# EAGLE design Main (EAGLE 9.6.2)
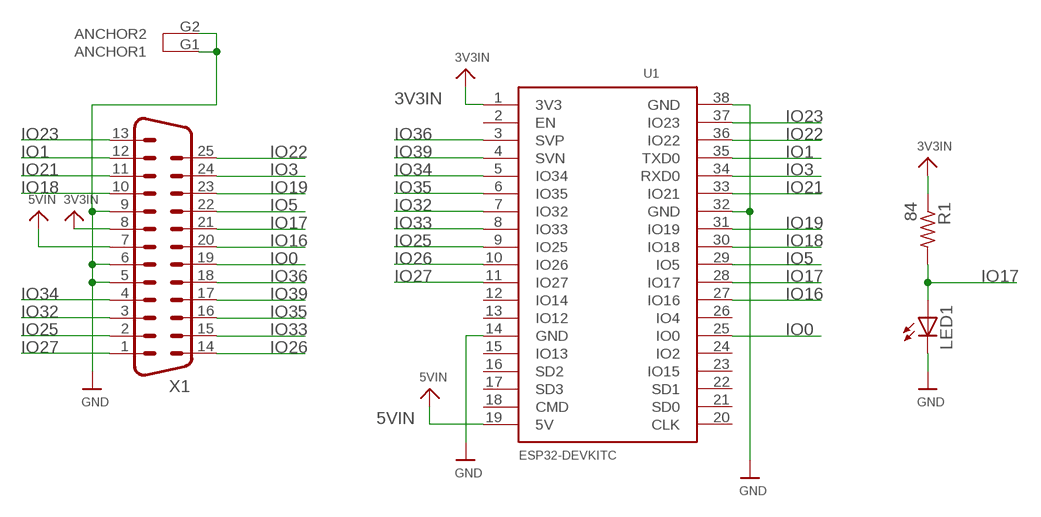
[diagram p0: schematic, sheet 1]

## Parts
LED1  LEDCHIPLED_1206  [CHIPLED_1206]
R1  84  R-US_R1206  [R1206]
U1  ESP32DEVKITC  [ESP32-DEVKITC]
X1  DB25_MALEHP  [M25HP]

## Nets
3V3IN: R1.1 U1.1(3V3) X1.8
5VIN: U1.19(5V) X1.7
GND: LED1.C U1.14(GND) U1.32(GND) U1.38(GND) X1.5 X1.6 X1.9 X1.G1(ANCHOR1) X1.G2(ANCHOR2)
IO0: U1.25(IO0) X1.19
IO1: U1.35(TXD0) X1.12
IO3: U1.34(RXD0) X1.24
IO5: U1.29(IO5) X1.22
IO16: U1.27(IO16) X1.20
IO17: LED1.A R1.2 U1.28(IO17) X1.21
IO18: U1.30(IO18) X1.10
IO19: U1.31(IO19) X1.23
IO21: U1.33(IO21) X1.11
IO22: U1.36(IO22) X1.25
IO23: U1.37(IO23) X1.13
IO25: U1.9(IO25) X1.2
IO26: U1.10(IO26) X1.14
IO27: U1.11(IO27) X1.1
IO32: U1.7(IO32) X1.3
IO33: U1.8(IO33) X1.15
IO34: U1.5(IO34) X1.4
IO35: U1.6(IO35) X1.16
IO36: U1.3(SVP) X1.18
IO39: U1.4(SVN) X1.17
Unconnected: U1.2(EN) U1.12(IO14) U1.13(IO12) U1.15(IO13) U1.16(SD2) U1.17(SD3) U1.18(CMD) U1.20(CLK) U1.21(SD0) U1.22(SD1) U1.23(IO15) U1.24(IO2) U1.26(IO4)

## Library data of the parts
LED1 = adafruit:LED: LED OSRAM: - CHIPLED LG R971, LG N971, LY N971, LG Q971, LY Q971, LO R971, LY R971 LH N974, LH R974 LS Q976, LO Q976, LY Q976 LO Q996 - Hyper CHIPLED LW Q18S LB Q993, LB Q99A, LB R99A - SideLED LS A670, LO A670, LY A670, LG A670, LP A670 LB A673, LV A673, LT A673, LW A673 LH A674 LY A675 LS A676, LA A676, LO A676, LY A676, LW A676 LS A679, LY A679, LG A679 - Hyper Micro SIDELED® LS Y876, LA Y876, LO Y876, LY Y876 LT Y87S - SmartLED LW L88C, LW L88S LB L89C, LB L89S, LG L890 LS L89K, LO L89K, LY L89K LS L896, LA L896, LO L896, LY L896 - TOPLED LS T670, LO T670, LY T670, LG T670, LP T670 LSG T670, LSP T670, LSY T670, LOP T670, LYG T670 LG T671, LOG T671, LSG T671 LB T673, LV T673, LT T673, LW T673 LH T674 LS T676, LA T676, LO T676, LY T676, LB T676, LH T676, LSB T676, LW T676 LB T67C, LV T67C, LT T67C, LS T67K, LO T67K, LY T67K, LW E67C LS E67B, LA E67B, LO E67B, LY E67B, LB E67C, LV E67C, LT E67C LW T67C LS T679, LY T679, LG T679 LS T770, LO T770, LY T770, LG T770, LP T770 LB T773, LV T773, LT T773, LW T773 LH T774 LS E675, LA E675, LY E675, LS T675 LS T776, LA T776, LO T776, LY T776, LB T776 LHGB T686 LT T68C, LB T68C - Hyper Mini TOPLED® LB M676 - Mini TOPLED Santana® LG M470 LS M47K, LO M47K, LY M47K Source: http://www.osram.convergy.de/
R1 = adafruit:R-US_: RESISTOR, American symbol
U1 = ESP32-DEVKITC4:ESP32DEVKITC
X1 = SparkFun-Retired:DB25_MALE: Various DB25 connectors

## Board
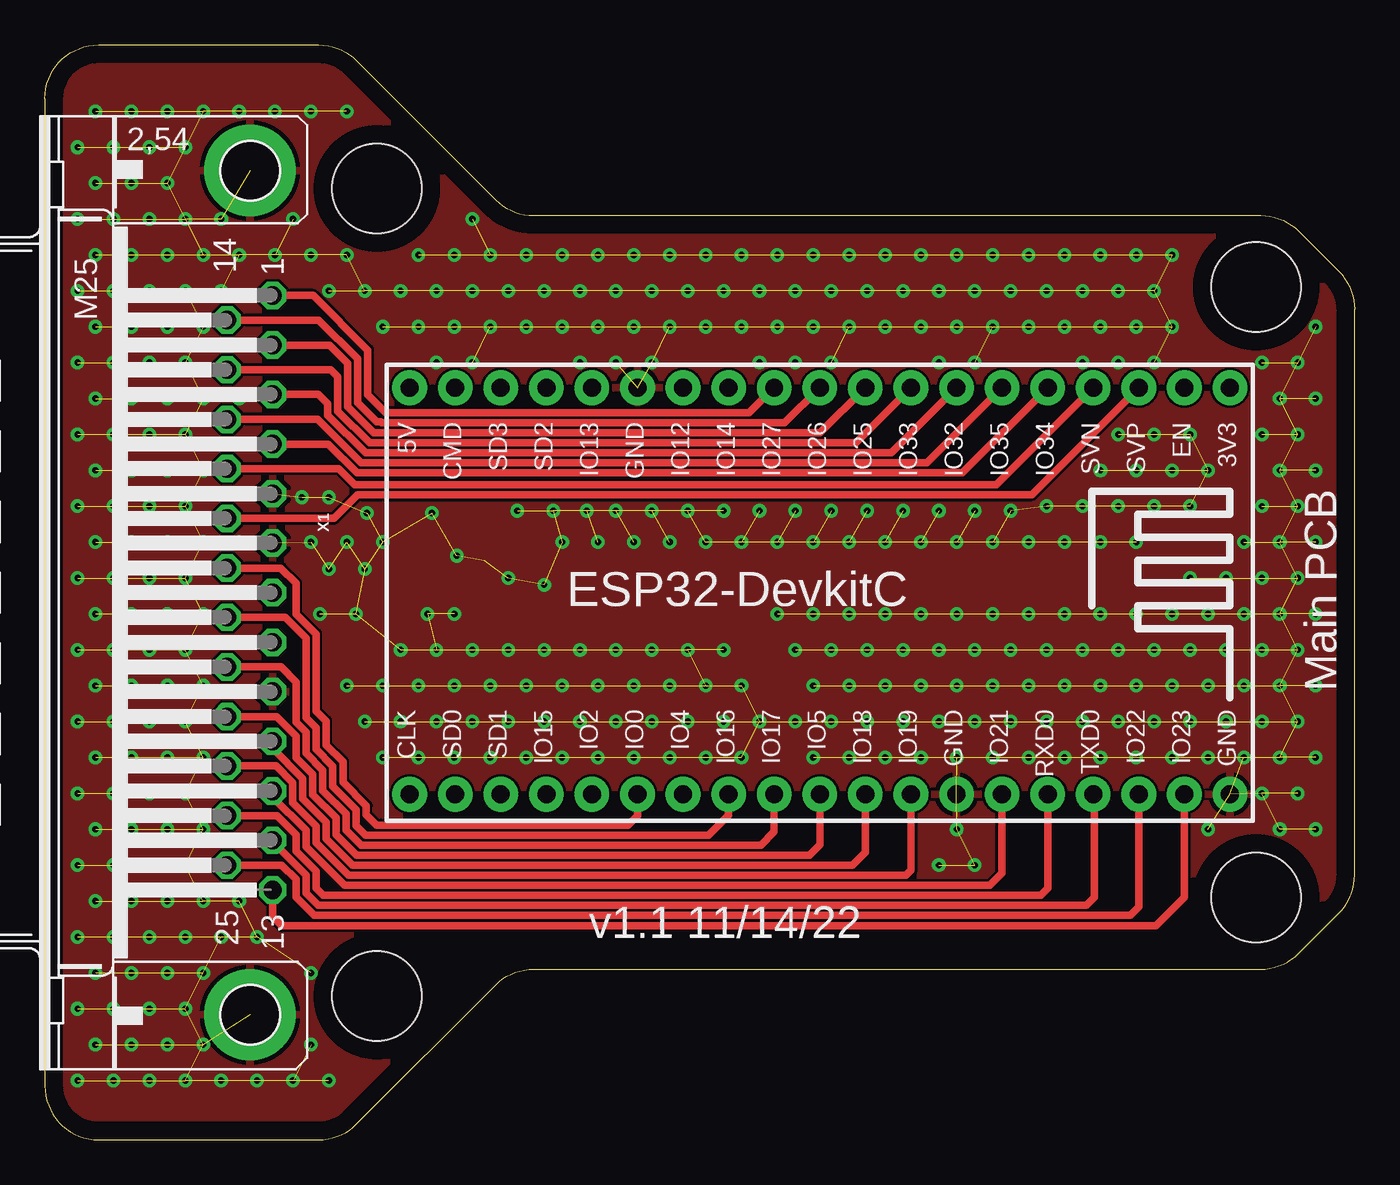
[diagram p1: board, top side]
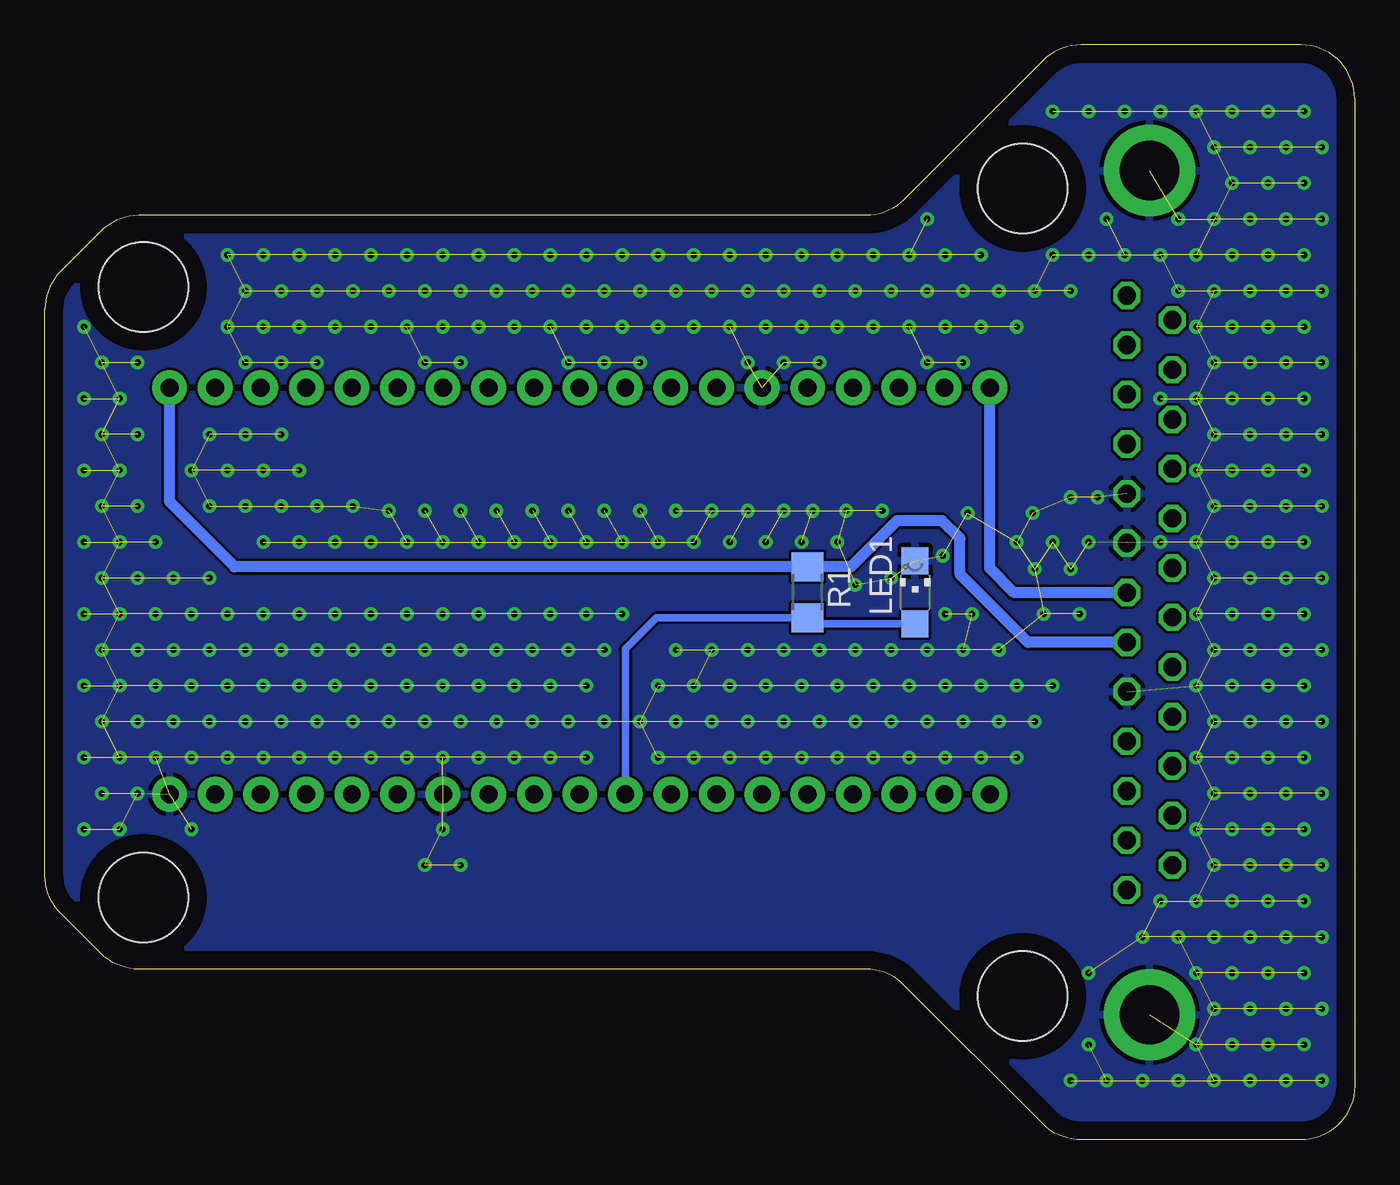
[diagram p2: board, bottom side, seen from below]

Size 73 x 61 mm. Coordinates in mm from the lower left corner, seen from the top.
Outline: 0,58 0,3 arc90 3,0 15.26,0 arc45 17.38,0.88 25.12,8.62 arc-45 27.24,9.5 67.76,9.5 arc45 69.88,10.38 72.12,12.62 arc45 73,14.74 73,46.26 arc45 72.12,48.38 69.88,50.62 arc45 67.76,51.5 27.24,51.5 arc-45 25.12,52.38 17.38,60.12 arc45 15.26,61 3,61 arc90 0,58
Copper layers (1*16): Top 0.035mm / dielectric 1.5mm / Bottom 0.035mm
Design rules "default": minimum track width 6mil, minimum drill 0.35mm, track to track 6mil, track to pad 6mil, pad to pad 6mil, via to via 6mil, smd to smd 6mil, copper to edge 40mil, drill to drill 6mil, minimum pad ring 10mil, minimum via ring 8mil, stop-mask expansion 4mil, vias tented up to drill 0.5mm, thermal gap 10mil
Holes 5 mm at 67.5,13.5 67.5,47.5 18.5,53 18.5,8

### Footprints (pad centres in the part's own frame; a part is rotated, then mirrored left to right if it is on the bottom)
CHIPLED_1206 = smd 1.5 x 1.5: A 0,-1.75; C 0,1.75
R1206 = smd 1.6 x 1.803: 1 -1.422,0; 2 1.422,0
ESP32-DEVKITC = drill 1 pad 1.93: 1 -22.87,-11.42; 2 -20.33,-11.42; 3 -17.79,-11.42; 4 -15.25,-11.42; 5 -12.71,-11.42; 6 -10.17,-11.42; 7 -7.63,-11.42; 8 -5.09,-11.42; 9 -2.55,-11.42; 10 -0.01,-11.42; 11 2.53,-11.42; 12 5.07,-11.42; 13 7.61,-11.42; 14 10.15,-11.42; 15 12.69,-11.42; 16 15.23,-11.42; 17 17.77,-11.42; 18 20.31,-11.42; 19 22.85,-11.42; 20 22.85,11.23; 21 20.31,11.23; 22 17.77,11.23; 23 15.23,11.23; 24 12.69,11.23; 25 10.15,11.23; 26 7.61,11.23; 27 5.07,11.23; 28 2.53,11.23; 29 -0.01,11.23; 30 -2.55,11.23; 31 -5.09,11.23; 32 -7.63,11.23; 33 -10.17,11.23; 34 -12.71,11.23; 35 -15.25,11.23; 36 -17.79,11.23; 37 -20.33,11.23; 38 -22.87,11.23
M25HP = drill 1.016 octagon: 1 -16.561,1.27; 2 -13.792,1.27; 3 -11.049,1.27; 4 -8.28,1.27; 5 -5.512,1.27; 6 -2.769,1.27; 7 0,1.27; 8 2.769,1.27; 9 5.512,1.27; 10 8.28,1.27; 11 11.049,1.27; 12 13.792,1.27; 13 16.561,1.27; 14 -15.189,-1.27; 15 -12.421,-1.27; 16 -9.652,-1.27; 17 -6.909,-1.27; 18 -4.14,-1.27; 19 -1.372,-1.27; 20 1.372,-1.27; 21 4.14,-1.27; 22 6.909,-1.27; 23 9.652,-1.27; 24 12.421,-1.27; 25 15.189,-1.27 | drill 3.302 pad 5.08: G1 -23.52,0; G2 23.52,0

### Placement (x,y rotation side)
LED1  24.5,30.5 0 bottom
R1  30.5,30.5 270 bottom
U1  43.18,30.48 180 top
X1  11.43,30.48 270 top

### Tracks (layer width: path | path; a pad name or v marks a point on that pad's centre or on a via)
3V3IN
  Bottom 0.61: X1.8 18.21,27.71 22,31.5 22,33.5 23,34.5 25.5,34.5 28.08,31.92 R1.1 62.42,31.92 66.05,35.55 U1.1
5VIN
  Bottom 0.61: X1.7 18.98,30.48 20.33,31.83 U1.19
GND  (via drill 0.35)  (431 unrouted)
  other vias: 1.83,3.3 2.83,5.3 1.83,7.3 2.83,9.3 1.83,11.3 2.83,13.3 1.83,15.3 2.83,17.3 1.83,19.3 2.83,21.3 1.83,23.3 2.83,25.3 1.83,27.3 2.83,29.3 1.83,31.3 2.83,33.3 1.83,35.3 2.83,37.3 1.83,39.3 2.83,41.3 1.83,43.3 2.83,45.3 1.83,47.3 2.83,49.3 1.83,51.3 2.83,53.3 1.83,55.3 2.83,57.3 3.83,3.3 4.83,5.3 3.83,7.3 4.83,9.3 3.83,11.3 4.83,13.3 3.83,15.3 4.83,17.3 3.83,19.3 4.83,21.3 3.83,23.3 4.83,25.3 3.83,27.3 4.83,29.3 3.83,31.3 4.83,33.3 3.83,35.3 4.83,37.3 3.83,39.3 4.83,41.3 3.83,43.3 4.83,45.3 3.83,47.3 4.83,49.3 3.83,51.3 4.83,53.3 3.83,55.3 4.83,57.3 5.83,3.3 6.83,5.3 5.83,7.3 6.83,9.3 5.83,11.3 6.83,13.3 5.83,15.3 6.83,17.3 5.83,19.3 6.83,21.3 5.83,23.3 6.83,25.3 5.83,27.3 6.83,29.3 5.83,31.3 6.83,33.3 5.83,35.3 6.83,37.3 5.83,39.3 6.83,41.3 5.83,43.3 6.83,45.3 5.83,47.3 6.83,49.3 5.83,51.3 6.83,53.3 5.83,55.3 6.83,57.3 7.83,3.3 8.83,5.3 7.83,7.3 8.83,9.3 7.83,11.3 8.83,13.3 7.83,15.3 8.83,17.3 7.83,19.3 8.83,21.3 7.83,23.3 8.83,25.3 7.83,27.3 8.83,29.3 7.83,31.3 8.83,33.3 7.83,35.3 8.83,37.3 7.83,39.3 8.83,41.3 7.83,43.3 8.83,45.3 7.83,47.3 8.83,49.3 7.83,51.3 7.83,55.3 8.83,57.3 9.83,3.3 9.83,11.3 10.83,13.3 10.83,33.3 10.83,41.3 9.83,47.3 10.83,49.3 9.83,51.3 10.83,57.3 11.83,3.3 11.83,11.3 12.83,49.3 12.83,57.3 13.83,3.3 14.83,5.3 14.83,9.3 15.33,29.3 14.83,33.3 14.33,35.8 14.83,49.3 13.83,51.3 14.83,57.3 15.83,3.3 16.83,25.3 17.33,29.3 15.83,31.8 16.83,33.3 15.83,35.8 15.83,47.3 16.83,49.3 16.83,57.3 18.83,21.3 17.83,23.3 18.83,25.3 17.83,31.8 18.83,33.3 17.95,34.92 18.83,45.3 17.83,47.3 20.83,21.3 19.83,23.3 20.83,25.3 19.83,27.3 21.33,29.3 20.83,45.3 19.83,47.3 20.83,49.3 22.83,21.3 21.83,23.3 22.83,25.3 21.83,27.3 22.83,29.3 22.95,32.53 21.57,34.92 21.83,43.3 22.83,45.3 21.83,47.3 22.83,49.3 24.83,21.3 23.83,23.3 24.83,25.3 23.83,27.3 23.83,43.3 24.83,45.3 23.83,47.3 24.83,49.3 23.83,51.3 26.83,21.3 25.83,23.3 26.83,25.3 25.83,27.3 25.83,31.3 26.34,35.04 26.83,45.3 25.83,47.3 26.83,49.3 28.83,21.3 27.83,23.3 28.83,25.3 27.83,27.3 27.83,30.92 28.83,33.3 28.34,35.04 28.83,45.3 27.83,47.3 28.83,49.3 30.83,21.3 29.83,23.3 30.83,25.3 29.83,27.3 30.83,33.3 30.21,35.04 29.83,43.3 30.83,45.3 29.83,47.3 30.83,49.3 32.83,21.3 31.83,23.3 32.83,25.3 31.83,27.3 32.83,33.3 31.83,35.04 31.83,43.3 32.83,45.3 31.83,47.3 32.83,49.3 34.83,21.3 33.83,23.3 34.83,25.3 33.83,27.3 34.83,33.3 33.83,35.04 33.83,43.3 34.83,45.3 33.83,47.3 34.83,49.3 36.83,21.3 35.83,23.3 36.83,25.3 35.83,27.3 36.83,33.3 35.83,35.04 36.83,45.3 35.83,47.3 36.83,49.3 38.83,21.3 37.83,23.3 38.83,25.3 37.83,27.3 38.83,33.3 37.83,35.04 38.83,45.3 37.83,47.3 38.83,49.3 39.83,23.3 40.83,29.3 40.83,33.3 39.83,35.04 39.83,43.3 40.83,45.3 39.83,47.3 40.83,49.3 42.83,21.3 41.83,23.3 42.83,25.3 41.83,27.3 42.83,29.3 42.83,33.3 41.83,35.04 41.83,43.3 42.83,45.3 41.83,47.3 42.83,49.3 44.83,21.3 43.83,23.3 44.83,25.3 43.83,27.3 44.83,29.3 44.83,33.3 43.83,35.04 43.83,43.3 44.83,45.3 43.83,47.3 44.83,49.3 46.83,21.3 45.83,23.3 46.83,25.3 45.83,27.3 46.83,29.3 46.83,33.3 45.83,35.04 46.83,45.3 45.83,47.3 46.83,49.3 48.83,21.3 47.83,23.3 48.83,25.3 47.83,27.3 48.83,29.3 48.83,33.3 47.83,35.04 48.83,45.3 47.83,47.3 48.83,49.3 49.83,15.3 50.83,17.3 50.83,21.3 49.83,23.3 50.83,25.3 49.83,27.3 50.83,29.3 50.83,33.3 49.83,35.04 49.83,43.3 50.83,45.3 49.83,47.3 50.83,49.3 51.83,15.3 52.83,21.3 51.83,23.3 52.83,25.3 51.83,27.3 52.83,29.3 52.83,33.3 51.83,35.04 51.83,43.3 52.83,45.3 51.83,47.3 52.83,49.3 54.83,21.3 53.83,23.3 54.83,25.3 53.83,27.3 54.83,29.3 54.83,33.3 53.83,35.04 54.83,45.3 53.83,47.3 54.83,49.3 56.83,21.3 55.83,23.3 56.83,25.3 55.83,27.3 56.83,29.3 56.83,33.3 55.83,35.3 56.83,45.3 55.83,47.3 56.83,49.3 58.83,21.3 57.83,23.3 58.83,25.3 57.83,27.3 58.83,29.3 58.83,33.3 57.83,35.3 58.83,37.3 57.83,43.3 58.83,45.3 57.83,47.3 58.83,49.3 60.83,21.3 59.83,23.3 60.83,25.3 59.83,27.3 60.83,29.3 60.83,33.3 59.83,35.3 60.83,37.3 59.83,39.3 59.83,43.3 60.83,45.3 59.83,47.3 60.83,49.3 62.83,21.3 61.83,23.3 62.83,25.3 61.83,27.3 62.83,29.3 61.83,35.3 62.83,37.3 61.83,39.3 61.83,43.3 62.83,45.3 61.83,47.3 62.83,49.3 64.83,17.3 64.83,21.3 63.83,23.3 64.83,25.3 63.83,27.3 64.83,29.3 63.83,31.3 63.83,35.3 64.83,37.3 63.83,39.3 66.83,21.3 65.83,23.3 66.83,25.3 65.83,27.3 66.83,29.3 65.83,31.3 66.83,33.3 68.83,17.3 67.83,19.3 68.83,21.3 67.83,23.3 68.83,25.3 67.83,27.3 68.83,29.3 67.83,31.3 68.83,33.3 67.83,35.3 68.83,37.3 67.83,39.3 68.83,41.3 67.83,43.3 70.83,17.3 69.83,19.3 70.83,21.3 69.83,23.3 70.83,25.3 69.83,27.3 70.83,29.3 69.83,31.3 70.83,33.3 69.83,35.3 70.83,37.3 69.83,39.3 70.83,41.3 69.83,43.3 70.83,45.3
  pour Top: -0.5,-0.5 -0.5,61 15.5,61 28.5,61 28.5,51.5 73.5,51.5 73.5,42 73.5,9.5 64.5,9.5 29,9.5 29,0 29,-0.5
  pour Bottom: 0,0 0,61 28.5,61 28.5,51.5 73.5,51.5 73.5,9.5 28,9.5 28,0
IO0
  Top 0.406: U1.25 33.03,18.06 32.5,17.53 18.5,17.53 17.91,18.12 17.91,18.62 16.61,19.92 16.61,21.05 15.68,21.99 15.68,23.32 15.12,23.88 15.12,28.17 14,29.29 14,31 13.15,31.85 X1.19
IO1
  Top 0.406: U1.35 58.5,19.18 58.5,13.5 58.06,13.06 15.23,13.06 14.56,13.73 14.56,14.73 12.7,16.59 X1.12
IO3
  Top 0.406: U1.34 55.89,14.01 55.5,13.62 15.5,13.62 15.12,14 15.12,14.96 14,16.08 14,17 12.94,18.06 X1.24
IO5
  Top 0.406: U1.29 43.19,16.42 42.62,15.85 17.39,15.85 16.23,17.01 16.23,17.93 14.94,19.23 14.94,20.36 14,21.29 14,22.48 12.91,23.57 X1.22
IO16
  Top 0.406: X1.20 13.39,29.11 14.56,27.94 14.56,23.5 15.12,22.94 15.12,21.75 16.05,20.82 16.05,19.69 17.35,18.39 17.35,17.5 17.88,16.97 37,16.97 38.11,18.08 U1.27
IO17
  Top 0.406: U1.28 40.65,17.15 39.91,16.41 17.62,16.41 16.79,17.24 16.79,18.16 15.49,19.46 15.49,20.59 14.56,21.52 14.56,22.71 14,23.27 14,25.5 13.16,26.34 X1.21
  Bottom 0.406: U1.28 40.65,19.5 40.65,20.35 40.65,27.35 38.92,29.08 R1.2 30.17,28.75 LED1.A
IO18
  Top 0.406: U1.30 45.73,16.02 45,15.29 17.16,15.29 15.68,16.77 15.68,17.69 14.38,18.99 14.38,20.12 12.7,21.8 X1.10
IO19
  Top 0.406: U1.31 48.27,15.01 48,14.73 16.93,14.73 15.12,16.54 15.12,17.46 13.82,18.76 13.82,19.89 12.88,20.83 X1.23
IO21
  Top 0.406: U1.33 53.35,14.85 52.68,14.18 16.69,14.18 14.56,16.31 14.56,17.23 12.7,19.09 X1.11
IO22
  Top 0.406: U1.36 60.97,12.97 60.5,12.5 15,12.5 14,13.5 14,14.5 13.21,15.29 X1.25
IO23
  Top 0.406: X1.13 12.7,12.42 13.2,11.92 61.92,11.92 63.51,13.51 U1.37
IO25
  Top 0.406: X1.2 15.88,44.27 16.88,43.27 16.88,40.83 18.33,39.38 43.21,39.38 U1.9
IO26
  Top 0.406: U1.10 41.23,39.94 18.77,39.94 18.71,40 18.5,40 17.44,41.06 17.44,43.5 15.27,45.67 X1.14
IO27
  Top 0.406: U1.11 39.25,40.5 19,40.5 18,41.5 18,44 14.96,47.04 X1.1
IO32
  Top 0.406: X1.3 15.24,41.53 15.77,41 15.77,40.36 17.86,38.27 47.17,38.27 U1.7
IO33
  Top 0.406: U1.8 45.19,38.82 18.1,38.82 16.32,40.6 16.32,42.5 15.92,42.9 X1.15
IO34
  Top 0.406: X1.4 15.79,38.76 17.4,37.15 51.14,37.15 U1.5
IO35
  Top 0.406: U1.6 49.16,37.71 17.63,37.71 15.21,40.13 X1.16
IO36
  Top 0.406: X1.18 16.12,34.62 17.44,35.94 55.01,35.94 U1.3
IO39
  Top 0.406: U1.4 53.03,36.5 17.26,36.5 16.37,37.39 X1.17

### Text on the board
tPlace: Main PCB | v1.1 11/14/22